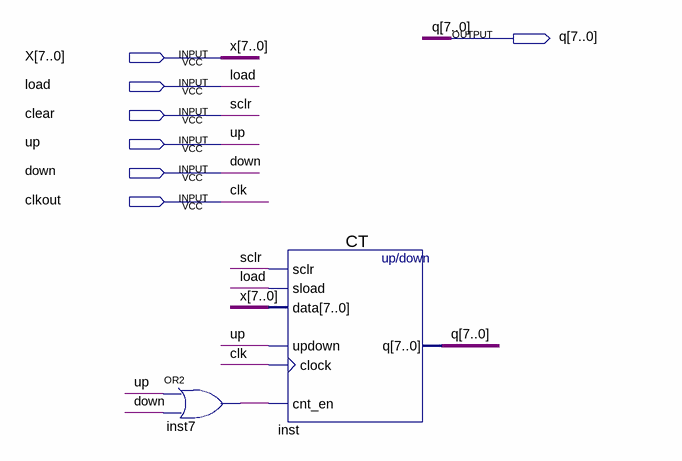
[diagram p0: schematic sheet]
// Quartus schematic CT1.bdf as structural Verilog: 2 symbols, 7 pins
module CT1 (
  input  [7:0] X,
  input  load,
  input  clear,
  input  up,
  input  down,
  input  clkout,
  output [7:0] q
);

  wire inst7_out;

  or inst7 (inst7_out, up, down);
  CT inst (.sclr(clear), .sload(load), .data(X), .updown(up), .clock(clkout), .cnt_en(inst7_out), .q(q));

  // Other names for the same wires on the sheet: clk = clkout; sclr = clear
endmodule
